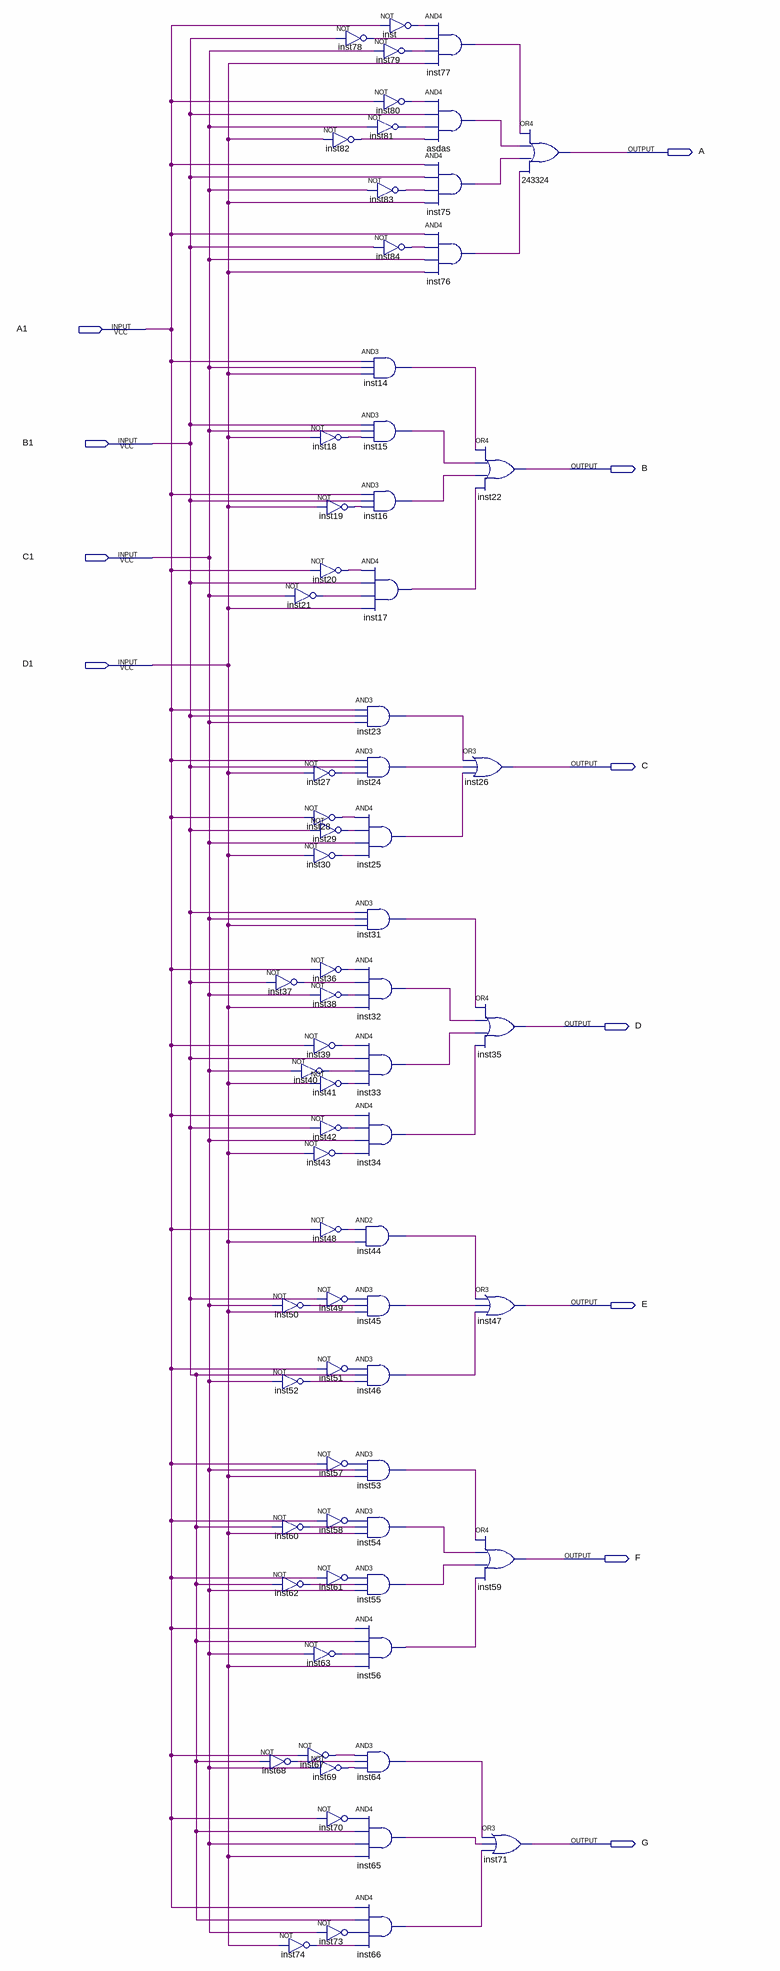
[diagram p0: schematic sheet]
// Quartus schematic DISPLAYAAAA.bdf as structural Verilog: 73 symbols, 11 pins
module DISPLAYAAAA (
  input  A1,
  input  B1,
  input  C1,
  input  D1,
  output A,
  output B,
  output C,
  output D,
  output E,
  output F,
  output G
);

  wire asdas_out, inst14_out, inst15_out, inst16_out, inst17_out, inst18_out, inst19_out, inst20_out,
       inst21_out, inst23_out, inst24_out, inst25_out, inst27_out, inst28_out, inst29_out, inst30_out,
       inst31_out, inst32_out, inst33_out, inst34_out, inst36_out, inst37_out, inst38_out, inst39_out,
       inst40_out, inst41_out, inst42_out, inst43_out, inst44_out, inst45_out, inst46_out, inst48_out,
       inst49_out, inst50_out, inst51_out, inst52_out, inst53_out, inst54_out, inst55_out, inst56_out,
       inst57_out, inst58_out, inst60_out, inst61_out, inst62_out, inst63_out, inst64_out, inst65_out,
       inst66_out, inst67_out, inst68_out, inst69_out, inst70_out, inst73_out, inst74_out, inst75_out,
       inst76_out, inst77_out, inst78_out, inst79_out, inst80_out, inst81_out, inst82_out, inst83_out,
       inst84_out, inst_out;

  not inst21 (inst21_out, C1);
  not inst37 (inst37_out, B1);
  not inst40 (inst40_out, C1);
  not inst50 (inst50_out, C1);
  not inst52 (inst52_out, C1);
  not inst60 (inst60_out, B1);
  not inst62 (inst62_out, B1);
  not inst68 (inst68_out, B1);
  not inst74 (inst74_out, D1);
  not inst78 (inst78_out, B1);
  not inst82 (inst82_out, D1);
  not inst18 (inst18_out, D1);
  not inst19 (inst19_out, D1);
  not inst20 (inst20_out, A1);
  not inst27 (inst27_out, D1);
  not inst28 (inst28_out, A1);
  not inst29 (inst29_out, B1);
  not inst30 (inst30_out, D1);
  not inst36 (inst36_out, A1);
  not inst38 (inst38_out, C1);
  not inst39 (inst39_out, A1);
  not inst41 (inst41_out, D1);
  not inst42 (inst42_out, B1);
  not inst43 (inst43_out, D1);
  not inst48 (inst48_out, A1);
  not inst49 (inst49_out, B1);
  not inst51 (inst51_out, A1);
  not inst57 (inst57_out, A1);
  not inst58 (inst58_out, A1);
  not inst61 (inst61_out, A1);
  not inst63 (inst63_out, C1);
  not inst67 (inst67_out, A1);
  not inst69 (inst69_out, C1);
  not inst70 (inst70_out, A1);
  not inst73 (inst73_out, C1);
  not inst (inst_out, A1);
  not inst79 (inst79_out, C1);
  not inst80 (inst80_out, A1);
  not inst81 (inst81_out, C1);
  not inst83 (inst83_out, C1);
  not inst84 (inst84_out, B1);
  and inst14 (inst14_out, A1, C1, D1);
  and inst15 (inst15_out, B1, C1, inst18_out);
  and inst16 (inst16_out, A1, B1, inst19_out);
  and inst17 (inst17_out, inst20_out, B1, inst21_out, D1);
  and inst23 (inst23_out, A1, B1, C1);
  and inst24 (inst24_out, A1, B1, inst27_out);
  and inst25 (inst25_out, inst28_out, inst29_out, C1, inst30_out);
  and inst31 (inst31_out, B1, C1, D1);
  and inst32 (inst32_out, inst36_out, inst37_out, inst38_out, D1);
  and inst33 (inst33_out, inst39_out, B1, inst40_out, inst41_out);
  and inst34 (inst34_out, A1, inst42_out, C1, inst43_out);
  and inst44 (inst44_out, inst48_out, D1);
  and inst45 (inst45_out, inst49_out, inst50_out, D1);
  and inst46 (inst46_out, inst51_out, B1, inst52_out);
  and inst53 (inst53_out, inst57_out, C1, D1);
  and inst54 (inst54_out, inst58_out, inst60_out, D1);
  and inst55 (inst55_out, inst61_out, inst62_out, C1);
  and inst56 (inst56_out, A1, B1, inst63_out, D1);
  and inst64 (inst64_out, inst67_out, inst68_out, inst69_out);
  and inst65 (inst65_out, inst70_out, B1, C1, D1);
  and inst66 (inst66_out, A1, B1, inst73_out, inst74_out);
  and inst77 (inst77_out, inst_out, inst78_out, inst79_out, D1);
  and asdas (asdas_out, inst80_out, B1, inst81_out, inst82_out);
  and inst75 (inst75_out, A1, B1, inst83_out, D1);
  and inst76 (inst76_out, A1, inst84_out, C1, D1);
  or inst22 (B, inst14_out, inst15_out, inst16_out, inst17_out);
  or inst26 (C, inst23_out, inst24_out, inst25_out);
  or inst35 (D, inst31_out, inst32_out, inst33_out, inst34_out);
  or inst47 (E, inst44_out, inst45_out, inst46_out);
  or inst59 (F, inst53_out, inst54_out, inst55_out, inst56_out);
  or inst71 (G, inst64_out, inst65_out, inst66_out);
  or u_243324 (A, inst77_out, asdas_out, inst75_out, inst76_out);
endmodule
